# Altium project ATmega328 Circuit_Project.PrjPcb
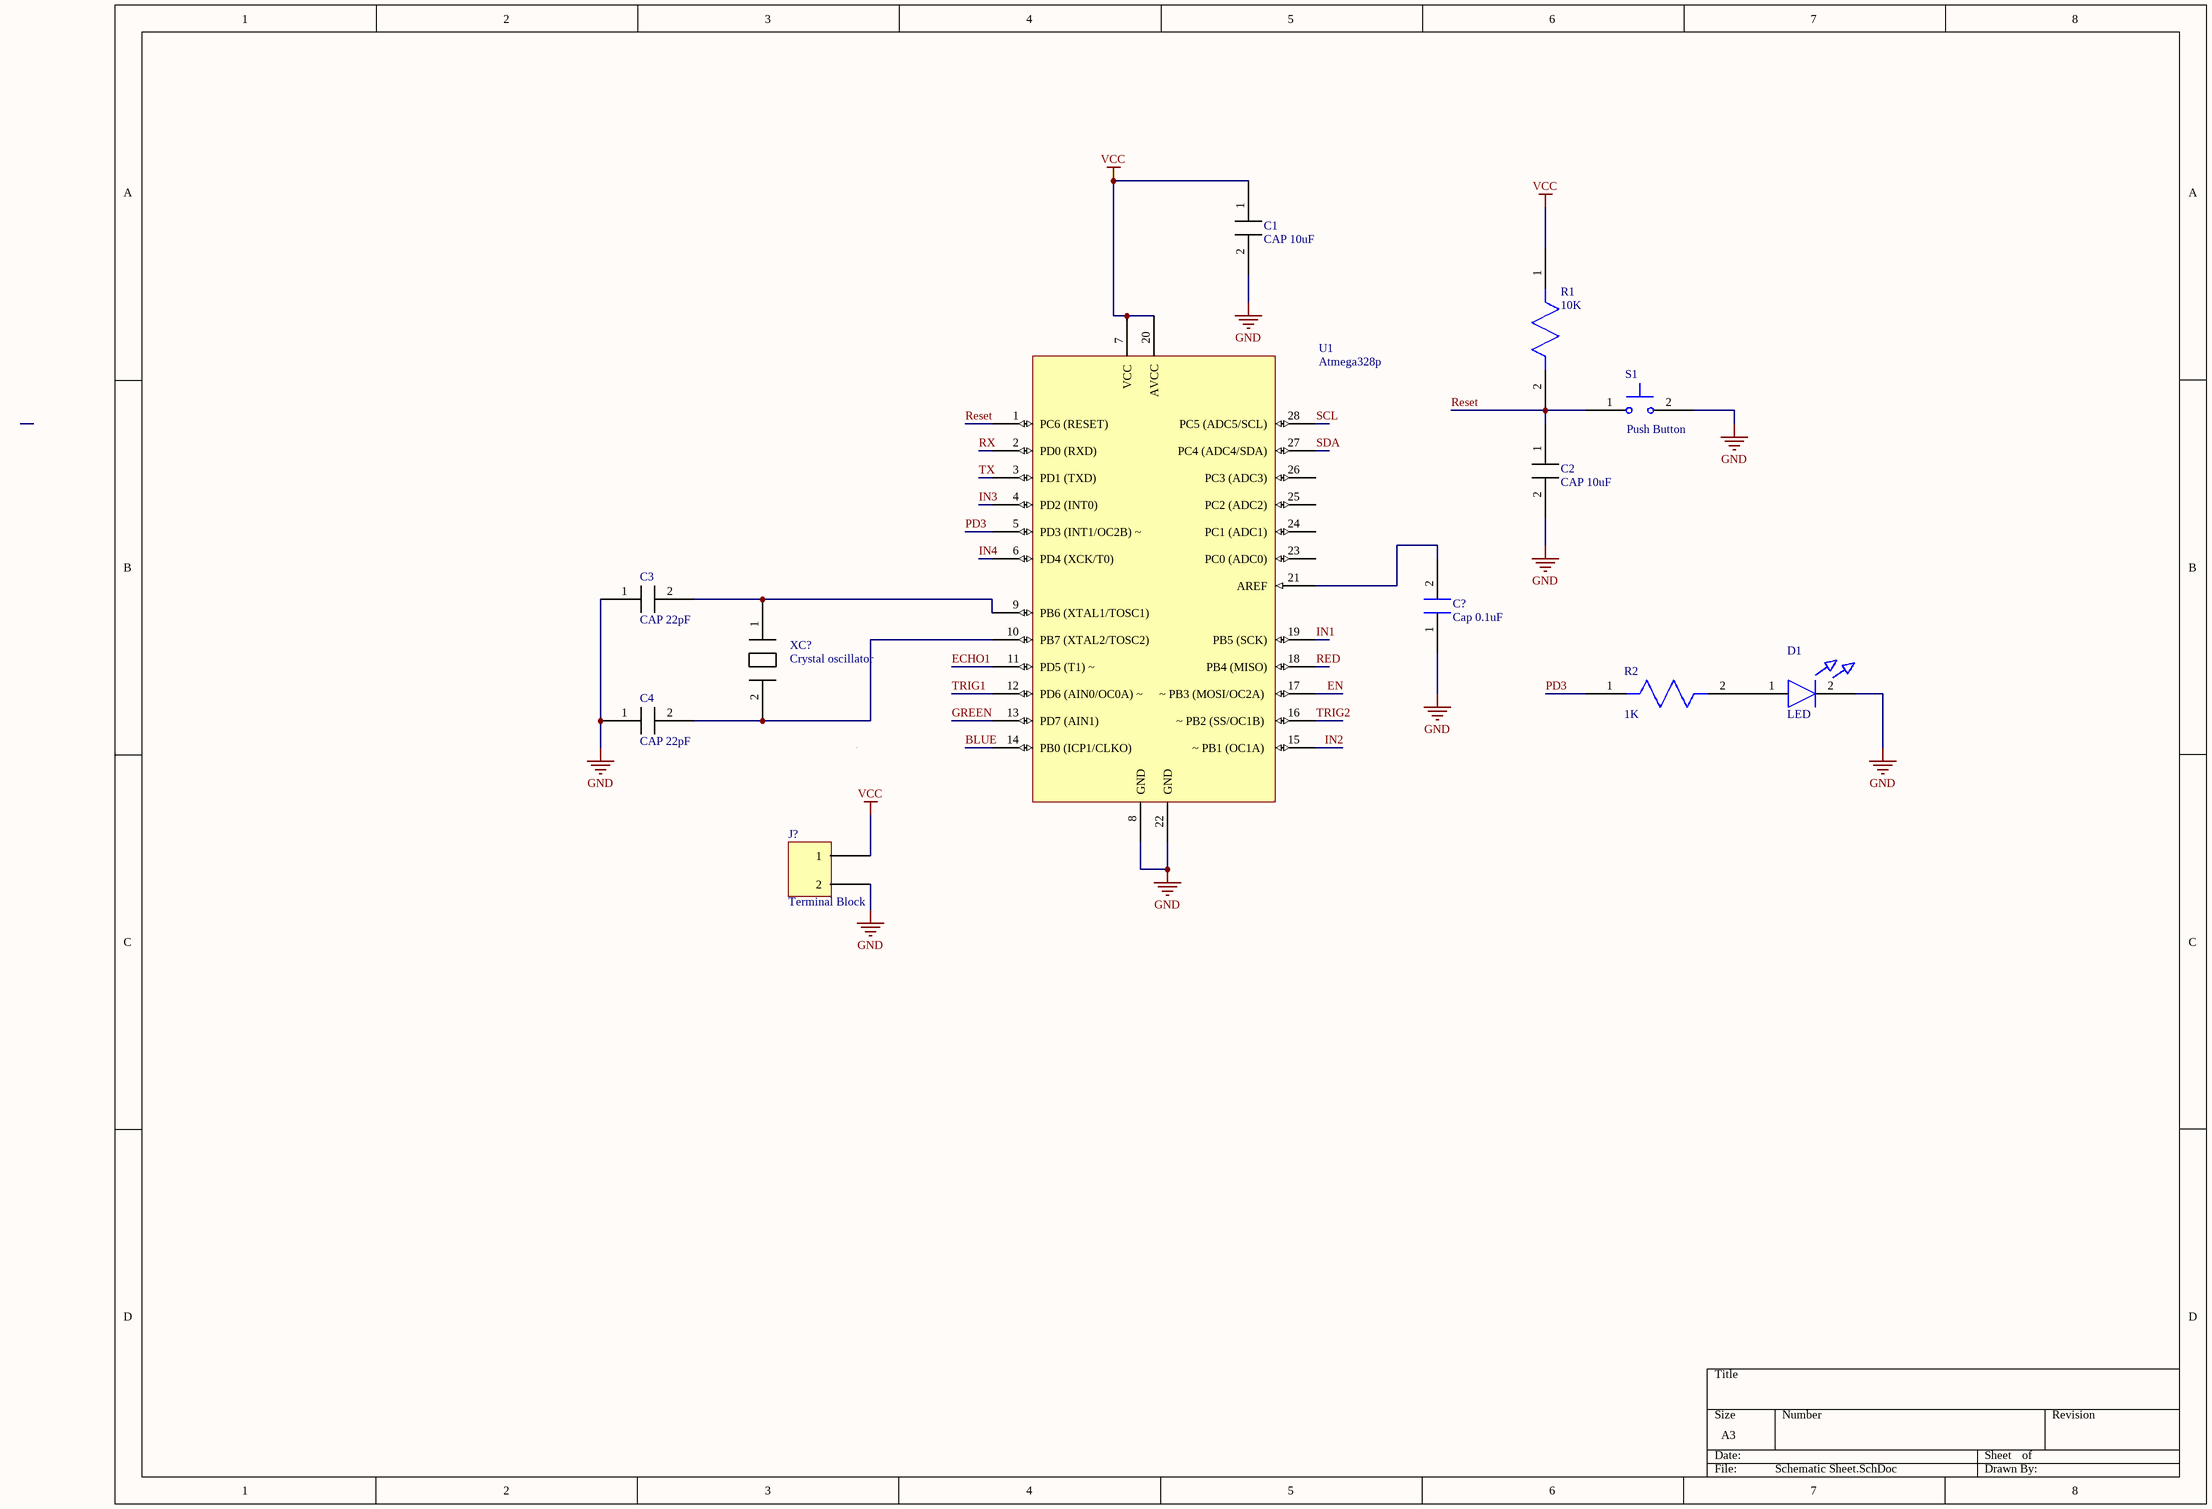
[diagram p0: Schematic Sheet.SchDoc]
1 sheet, 12 parts. Net scope: global (net labels, ports and power ports of the same name join across sheets).
Board file: PCB1.PcbDoc

## Sheet Schematic Sheet.SchDoc
size A3; SheetNumber: 1; SheetTotal: 1

### Parts
C1  CAP 10uF
C2  CAP 10uF
C3  CAP 22pF
C4  CAP 22pF
C?  Cap 0.1uF
D1  LED
J?  Terminal Block  [Terminal Block 2pin]
R1  10K
R2  1K
S1  Push Button
U1  Atmega328p  [ATMega 328 P-PU - duplicate]
XC?  Crystal oscillator

### Nets
GND: C1.2 C2.2 C3.1 C4.1 C?.1 D1.2 J?.2 S1.2 U1.8(GND) U1.22(GND)
VCC: C1.1 J?.1 R1.1 U1.7(VCC) U1.20(AVCC)
BLUE: U1.14(PB0_(ICP1/CLKO))
ECHO1: U1.11(PD5_(T1)_~)
EN: U1.17(~_PB3_(MOSI/OC2A))
GREEN: U1.13(PD7_(AIN1))
IN1: U1.19(PB5_(SCK))
IN2: U1.15(~_PB1_(OC1A))
IN3: U1.4(PD2_(INT0))
IN4: U1.6(PD4_(XCK/T0))
PD3: R2.1 U1.5(PD3_(INT1/OC2B)_~)
RED: U1.18(PB4_(MISO))
Reset: C2.1 R1.2 S1.1 U1.1(PC6_(RESET))
RX: U1.2(PD0_(RXD))
SCL: U1.28(PC5_(ADC5/SCL))
SDA: U1.27(PC4_(ADC4/SDA))
TRIG1: U1.12(PD6_(AIN0/OC0A)_~)
TRIG2: U1.16(~_PB2_(SS/OC1B))
TX: U1.3(PD1_(TXD))
NetC3_2: C3.2 U1.9(PB6_(XTAL1/TOSC1)) XC?.1
NetC4_2: C4.2 U1.10(PB7_(XTAL2/TOSC2)) XC?.2
NetC?_2: C?.2 U1.21(AREF)
NetD1_1: D1.1 R2.2

Not connected (* = marked no-connect by the designer): U1 23(PC0_(ADC0)) 24(PC1_(ADC1)) 25(PC2_(ADC2)) 26(PC3_(ADC3))

### Library data of the parts
R1 R2 = Resistor